# Altium schematic sheet LCD.SchDoc
size B; DocumentNumber: 11; SheetNumber: 11; SheetTotal: 13
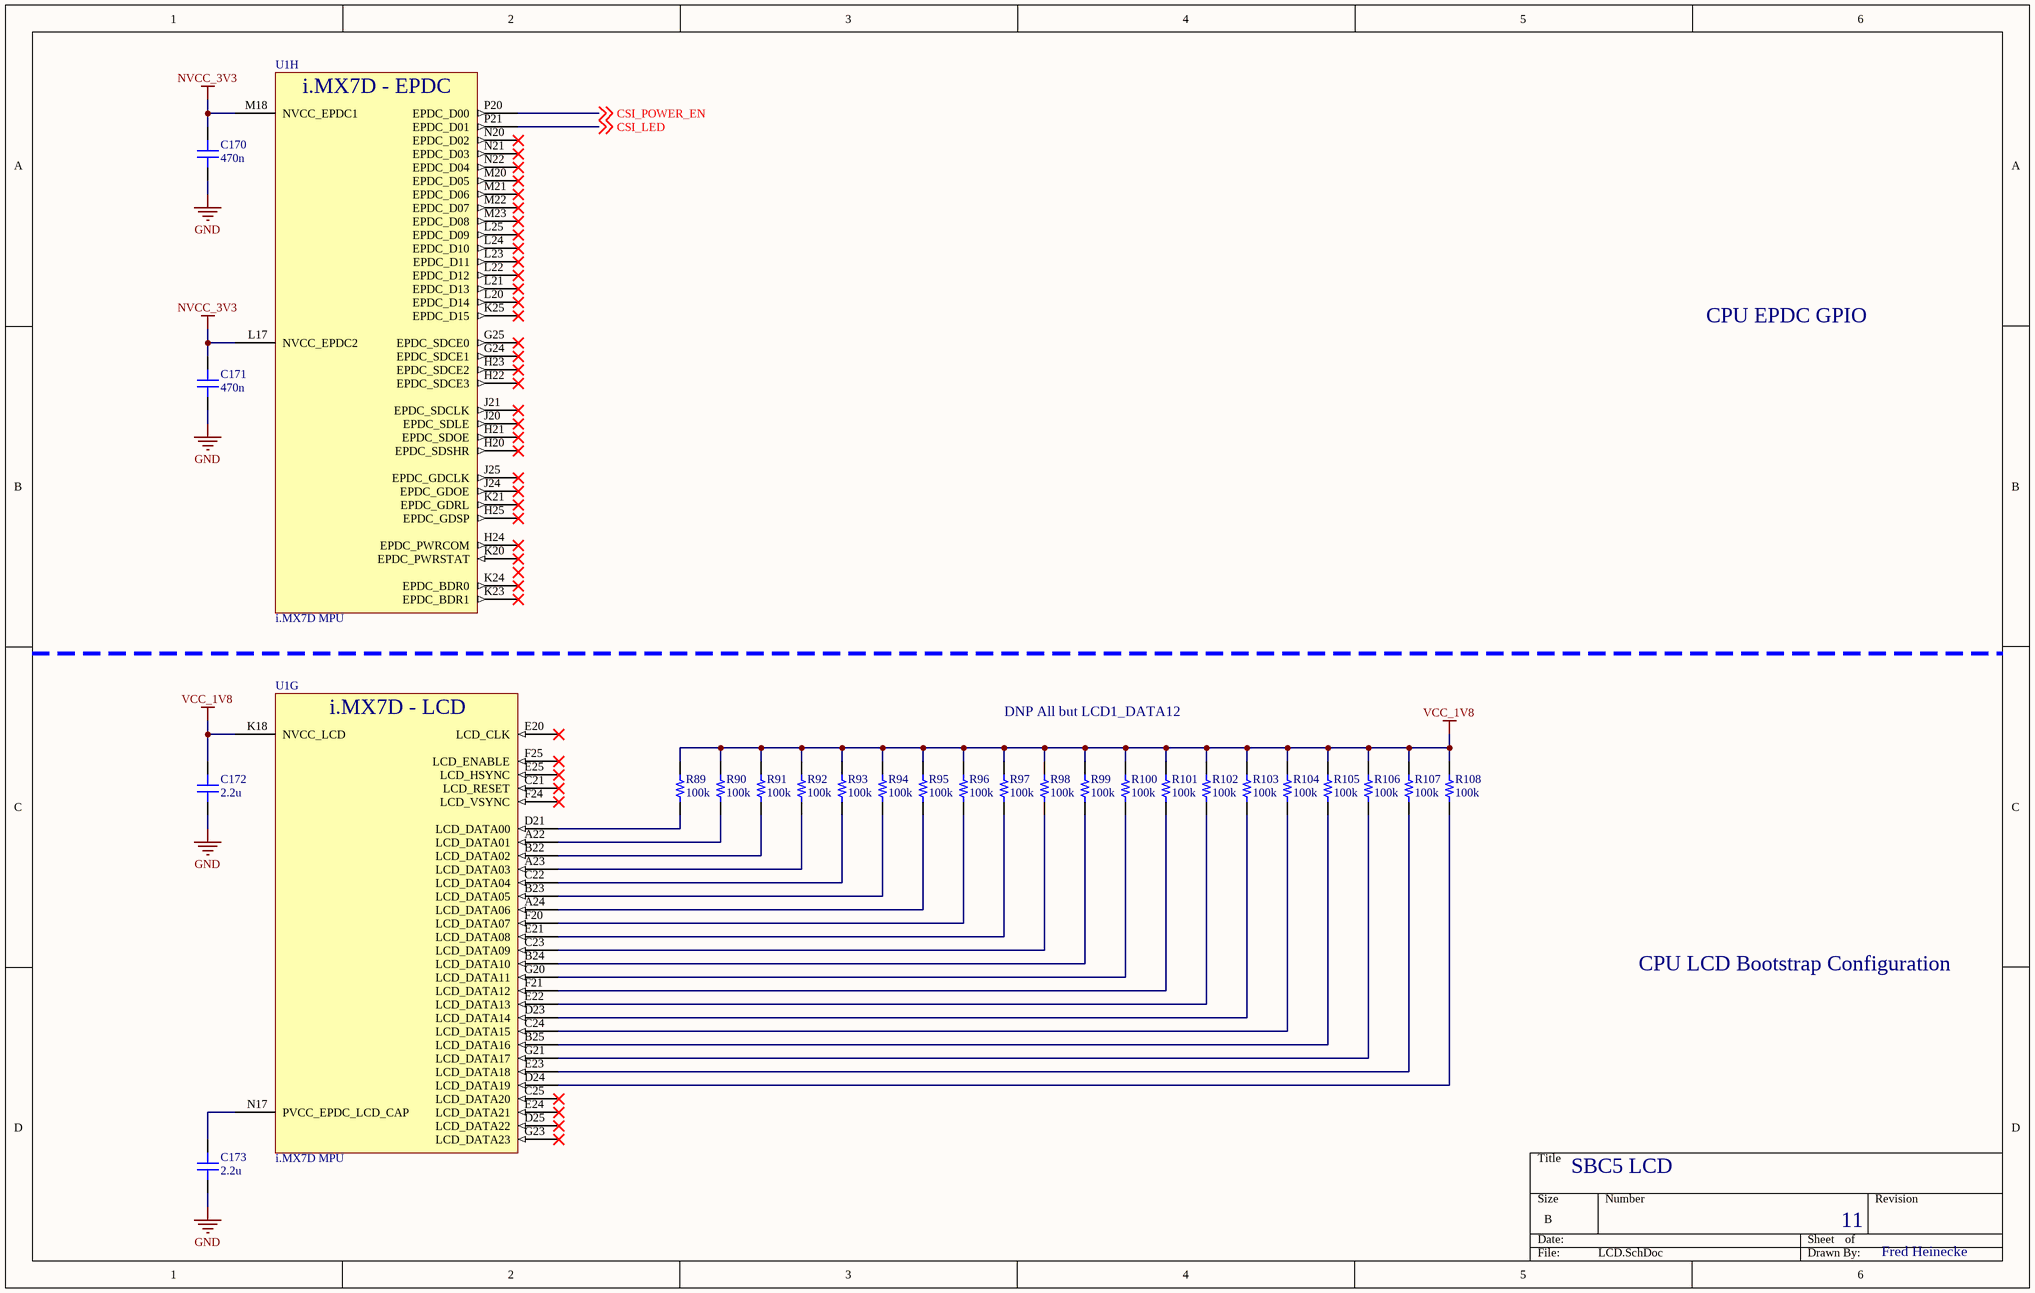
[diagram p0: LCD.SchDoc]

## Parts
C170  470n  [C0402]
C171  470n  [C0402]
C172  2.2u  [C0402]
C173  2.2u  [C0402]
R89  100k  [R0201]
R90  100k  [R0201]
R91  100k  [R0201]
R92  100k  [R0201]
R93  100k  [R0201]
R94  100k  [R0201]
R95  100k  [R0201]
R96  100k  [R0201]
R97  100k  [R0201]
R98  100k  [R0201]
R99  100k  [R0201]
R100  100k  [R0201]
R101  100k  [R0201]
R102  100k  [R0201]
R103  100k  [R0201]
R104  100k  [R0201]
R105  100k  [R0201]
R106  100k  [R0201]
R107  100k  [R0201]
R108  100k  [R0201]
U1  i.MX7D MPU  [BGA541C75P25X25_1900X1900X140]  (parts G,H of 23)

## Nets
GND: C170.1 C171.1 C172.1 C173.1
NVCC_3V3: C170.2 C171.2 U1.L17(NVCC_EPDC2) U1.M18(NVCC_EPDC1)
VCC_1V8: C172.2 R89.2 R90.2 R91.2 R92.2 R93.2 R94.2 R95.2 R96.2 R97.2 R98.2 R99.2 R100.2 R101.2 R102.2 R103.2 R104.2 R105.2 R106.2 R107.2 R108.2 U1.K18(NVCC_LCD)
CSI_LED: U1.P21(EPDC_D01) ; off-sheet CSI_LED
CSI_POWER_EN: U1.P20(EPDC_D00) ; off-sheet CSI_POWER_EN
NetC173_2: C173.2 U1.N17(PVCC_EPDC_LCD_CAP)
NetR89_1: R89.1 U1.D21(LCD_DATA00)
NetR90_1: R90.1 U1.A22(LCD_DATA01)
NetR91_1: R91.1 U1.B22(LCD_DATA02)
NetR92_1: R92.1 U1.A23(LCD_DATA03)
NetR93_1: R93.1 U1.C22(LCD_DATA04)
NetR94_1: R94.1 U1.B23(LCD_DATA05)
NetR95_1: R95.1 U1.A24(LCD_DATA06)
NetR96_1: R96.1 U1.F20(LCD_DATA07)
NetR97_1: R97.1 U1.E21(LCD_DATA08)
NetR98_1: R98.1 U1.C23(LCD_DATA09)
NetR99_1: R99.1 U1.B24(LCD_DATA10)
NetR100_1: R100.1 U1.G20(LCD_DATA11)
NetR101_1: R101.1 U1.F21(LCD_DATA12)
NetR102_1: R102.1 U1.E22(LCD_DATA13)
NetR103_1: R103.1 U1.D23(LCD_DATA14)
NetR104_1: R104.1 U1.C24(LCD_DATA15)
NetR105_1: R105.1 U1.B25(LCD_DATA16)
NetR106_1: R106.1 U1.G21(LCD_DATA17)
NetR107_1: R107.1 U1.E23(LCD_DATA18)
NetR108_1: R108.1 U1.D24(LCD_DATA19)

Not connected (* = marked no-connect by the designer): U1 C21(LCD_RESET)* C25(LCD_DATA20)* D25(LCD_DATA22)* E20(LCD_CLK)* E24(LCD_DATA21)* E25(LCD_HSYNC)* F24(LCD_VSYNC)* F25(LCD_ENABLE)* G23(LCD_DATA23)* G24(EPDC_SDCE1)* G25(EPDC_SDCE0)* H20(EPDC_SDSHR)* H21(EPDC_SDOE)* H22(EPDC_SDCE3)* H23(EPDC_SDCE2)* H24(EPDC_PWRCOM)* H25(EPDC_GDSP)* J20(EPDC_SDLE)* J21(EPDC_SDCLK)* J24(EPDC_GDOE)* J25(EPDC_GDCLK)* K20(EPDC_PWRSTAT)* K21(EPDC_GDRL)* K23(EPDC_BDR1)* K24(EPDC_BDR0)* K25(EPDC_D15)* L20(EPDC_D14)* L21(EPDC_D13)* L22(EPDC_D12)* L23(EPDC_D11)* L24(EPDC_D10)* L25(EPDC_D09)* M20(EPDC_D05)* M21(EPDC_D06)* M22(EPDC_D07)* M23(EPDC_D08)* N20(EPDC_D02)* N21(EPDC_D03)* N22(EPDC_D04)*

## Notes on the sheet
- CPU EPDC GPIO
- DNP All but LCD1_DATA12
- CPU LCD Bootstrap Configuration
- SBC5 LCD
- 11
- Fred Heinecke
- (in symbol MCIMX7D2DVM12SD, part G) i.MX7D - LCD
- (in symbol MCIMX7D2DVM12SD, part H) i.MX7D - EPDC

## Library data of the parts
C170 C171 = CL05A474KP5NNNC: Cap Ceramic 0.47uF 10V X5R 10% SMD 0402 85C T/R; Manufacturer: Samsung; Capacitance: 470nF; Supplier 1: Digi-Key; Supplier Part Number 1: 1276-1173-1-ND; Manufacturer Part Number: CL05A474KP5NNNC; RoHS: Yes; Category: Ceramic Capacitors; Stock 1: 1598783; Pricing 1: 1=0.10000, 10=0.06000, 50=0.03260, 100=0.02670, 500=0.01906, 1000=0.01497, 2500=0.01361, 5000=0.01252 (USD); Mount: Surface Mount; Case/Package: 0402; Case Code (Metric): 1005; Case Code (Imperial): 0402; Min Operating Temperature: -55°C; Max Operating Temperature: 85°C; Tolerance: 10%; Dielectric: X5R; Packaging: Tape and Reel; Voltage Rating: 10V; Voltage Rating (DC): 10V; Series: CL; Construction: Flat; Length: 1mm; Width: 0.02inch; Height: 0.5mm; Thickness: 0.022inch; Depth: 0.5mm; Radiation Hardening: No; Lead Free: Lead Free; RoHS Compliant: Yes; ComponentLink1URL: https://datasheet.ciiva.com/25710/cl05a474kp5nnnc-25710324.pdf?src-supplier=Digi-Key; ComponentLink1Description: https://datasheet.ciiva.com/25710/cl05a474kp5nnnc-25710324.pdf?src-supplier=Digi-Key; ComponentLink2URL: https://datasheet.ciiva.com/26838/getdatasheetpartid-355286-26838191.pdf?src-supplier=Verical; ComponentLink2Description: https://datasheet.ciiva.com/26838/getdatasheetpartid-355286-26838191.pdf?src-supplier=Verical; ComponentLink3URL: https://datasheet.ciiva.com/16437/cl05b104kq5nnnc-16437351.pdf?src-supplier=Future+Electronics; ComponentLink3Description: https://datasheet.ciiva.com/16437/cl05b104kq5nnnc-16437351.pdf?src-supplier=Future+Electronics
C172 C173 = LMK105BJ225MV-F: TAIYO YUDEN         LMK105BJ225MV-F            CERAMIC CAPACITOR, 2.2UF, 10V, X5R, 20%, 0402; Supplier 1: Digi-Key; Manufacturer: Taiyo Yuden; Manufacturer Part Number: LMK105BJ225MV-F; RoHS: Yes; Category: Ceramic Capacitors; Stock 1: 422093; Pricing 1: 1=0.10000, 10=0.05800, 50=0.03160, 100=0.02590, 500=0.01848, 1000=0.01452, 2500=0.01320, 5000=0.01214 (USD); Mount: Surface Mount; Case/Package: 0402; Case Code (Imperial): 0402; Case Code (Metric): 1005; Min Operating Temperature: -55°C; Max Operating Temperature: 85°C; Termination: SMD/SMT; Packaging: Tape and Reel; Capacitance: 2.2uF; Tolerance: 20%; Voltage Rating: 10V; Package Quantity: 1; Voltage Rating (DC): 10V; Dielectric: X5R; Resistor Type: Ceramic; Length: 1mm; Width: 0.5mm; Height: 0.5mm; Thickness: 0.022inch; Depth: 0.5mm; Radiation Hardening: No; Halogen Free: Halogen Free; REACH SVHC: Unknown; ComponentLink1URL: https://datasheet.ciiva.com/30190/500lmk105bj225mv-f-30190498.pdf?src-supplier=Onlinecomponents.com; ComponentLink1Description: https://datasheet.ciiva.com/30190/500lmk105bj225mv-f-30190498.pdf?src-supplier=Onlinecomponents.com; ComponentLink2URL: https://datasheet.ciiva.com/23631/lmk105bj225mv-f-ss-23631491.pdf?src-supplier=Newark; ComponentLink2Description: https://datasheet.ciiva.com/23631/lmk105bj225mv-f-ss-23631491.pdf?src-supplier=Newark; ComponentLink3URL: https://datasheet.ciiva.com/134/lmk105bj225mv-f-ss-134677.pdf?src-supplier=Digi-Key; ComponentLink3Description: https://datasheet.ciiva.com/134/lmk105bj225mv-f-ss-134677.pdf?src-supplier=Digi-Key; ComponentLink4URL: https://datasheet.ciiva.com/15921/286lmk105bj225mv-f-15921222.pdf?src-supplier=Onlinecomponents.com; ComponentLink4Description: https://datasheet.ciiva.com/15921/286lmk105bj225mv-f-15921222.pdf?src-supplier=Onlinecomponents.com; Supplier Part Number 1: 587-3153-1-ND
R89-R108 = ERJ-1GNF1003C: PANASONIC - ERJ1GNF1003C - RES, 100K, 1%, 0.05W, 0201, THICK FILM; Resistance: 100kR; Temperature Coefficient: 200ppm/°C; Power Rating: 50mW; Voltage Rating: 25V; Supplier 1: Digi-Key; Supplier Part Number 1: P122655CT-ND; Manufacturer: Panasonic; Manufacturer Part Number: ERJ-1GNF1003C; RoHS: Yes; Category: Chip SMD Resistors; Stock 1: 833904; Pricing 1: 1=0.10000, 10=0.04600, 100=0.01890, 1000=0.00848, 2500=0.00736, 5000=0.00608 (USD); Mount: Surface Mount; Case/Package: 0201; Number of Pins: 2; Contact Plating: Tin,Matte; Case Code (Metric): 0603; Case Code (Imperial): 0201; Weight: 6E-06oz; Size Code: 0201; Min Operating Temperature: -55°C; Max Operating Temperature: 125°C; Tolerance: 1%; Resistor Type: Thick Film; Packaging: Tape and Reel; Package Quantity: 15000; Number of Terminations: 2; Max Power Dissipation: 50mW; Termination: SMD/SMT; Voltage Rating (DC): 25V; Series: ERJ; Resistance Tolerance: 1%; Length: 0.024inch; Width: 0.012inch; Height: 0.01inch; Radiation Hardening: No; REACH SVHC: No SVHC; Lead Free: Lead Free; RoHS Compliant: Yes; ComponentLink1URL: https://datasheet.ciiva.com/7830/1678782-7830709.pdf?src-supplier=Element14; ComponentLink1Description: https://datasheet.ciiva.com/7830/1678782-7830709.pdf?src-supplier=Element14; ComponentLink2URL: https://datasheet.ciiva.com/16508/aoa0000ce2-16508328.pdf?src-supplier=Future+Electronics; ComponentLink2Description: https://datasheet.ciiva.com/16508/aoa0000ce2-16508328.pdf?src-supplier=Future+Electronics; ComponentLink3URL: https://datasheet.ciiva.com/24161/aoa0000ce2-24161032.pdf?src-supplier=Mouser; ComponentLink3Description: https://datasheet.ciiva.com/24161/aoa0000ce2-24161032.pdf?src-supplier=Mouser; ComponentLink4URL: https://datasheet.ciiva.com/43467/1678782-43467102.pdf?src-supplier=Farnell; ComponentLink4Description: https://datasheet.ciiva.com/43467/1678782-43467102.pdf?src-supplier=Farnell
U1 = MCIMX7D2DVM12SD: Heterogeneous Multicore Processing Architecture; Manufacturer: NXP Freescale; Manufacturer Part Number: MCIMX7D2DVM12SD; Stock 1: 0; Pricing 1: 168=18.42238 (USD); ComponentLink1Description: Datasheet; ComponentLink1URL: https://www.nxp.com/docs/en/data-sheet/IMX7DCEC.pdf; ComponentLink2Description: Reference manual; ComponentLink2URL: https://www.nxp.com/docs/en/reference-manual/IMX7DRM.pdf; ComponentLink3Description: Hardware Development Guide; ComponentLink3URL: https://www.nxp.com/docs/en/user-guide/IMX7DSHDG.pdf; Supplier 1: Digi-Key; Supplier Part Number 1: 568-15401-ND